# EAGLE schematic emonDC v0.3a (EAGLE 7.7.0)
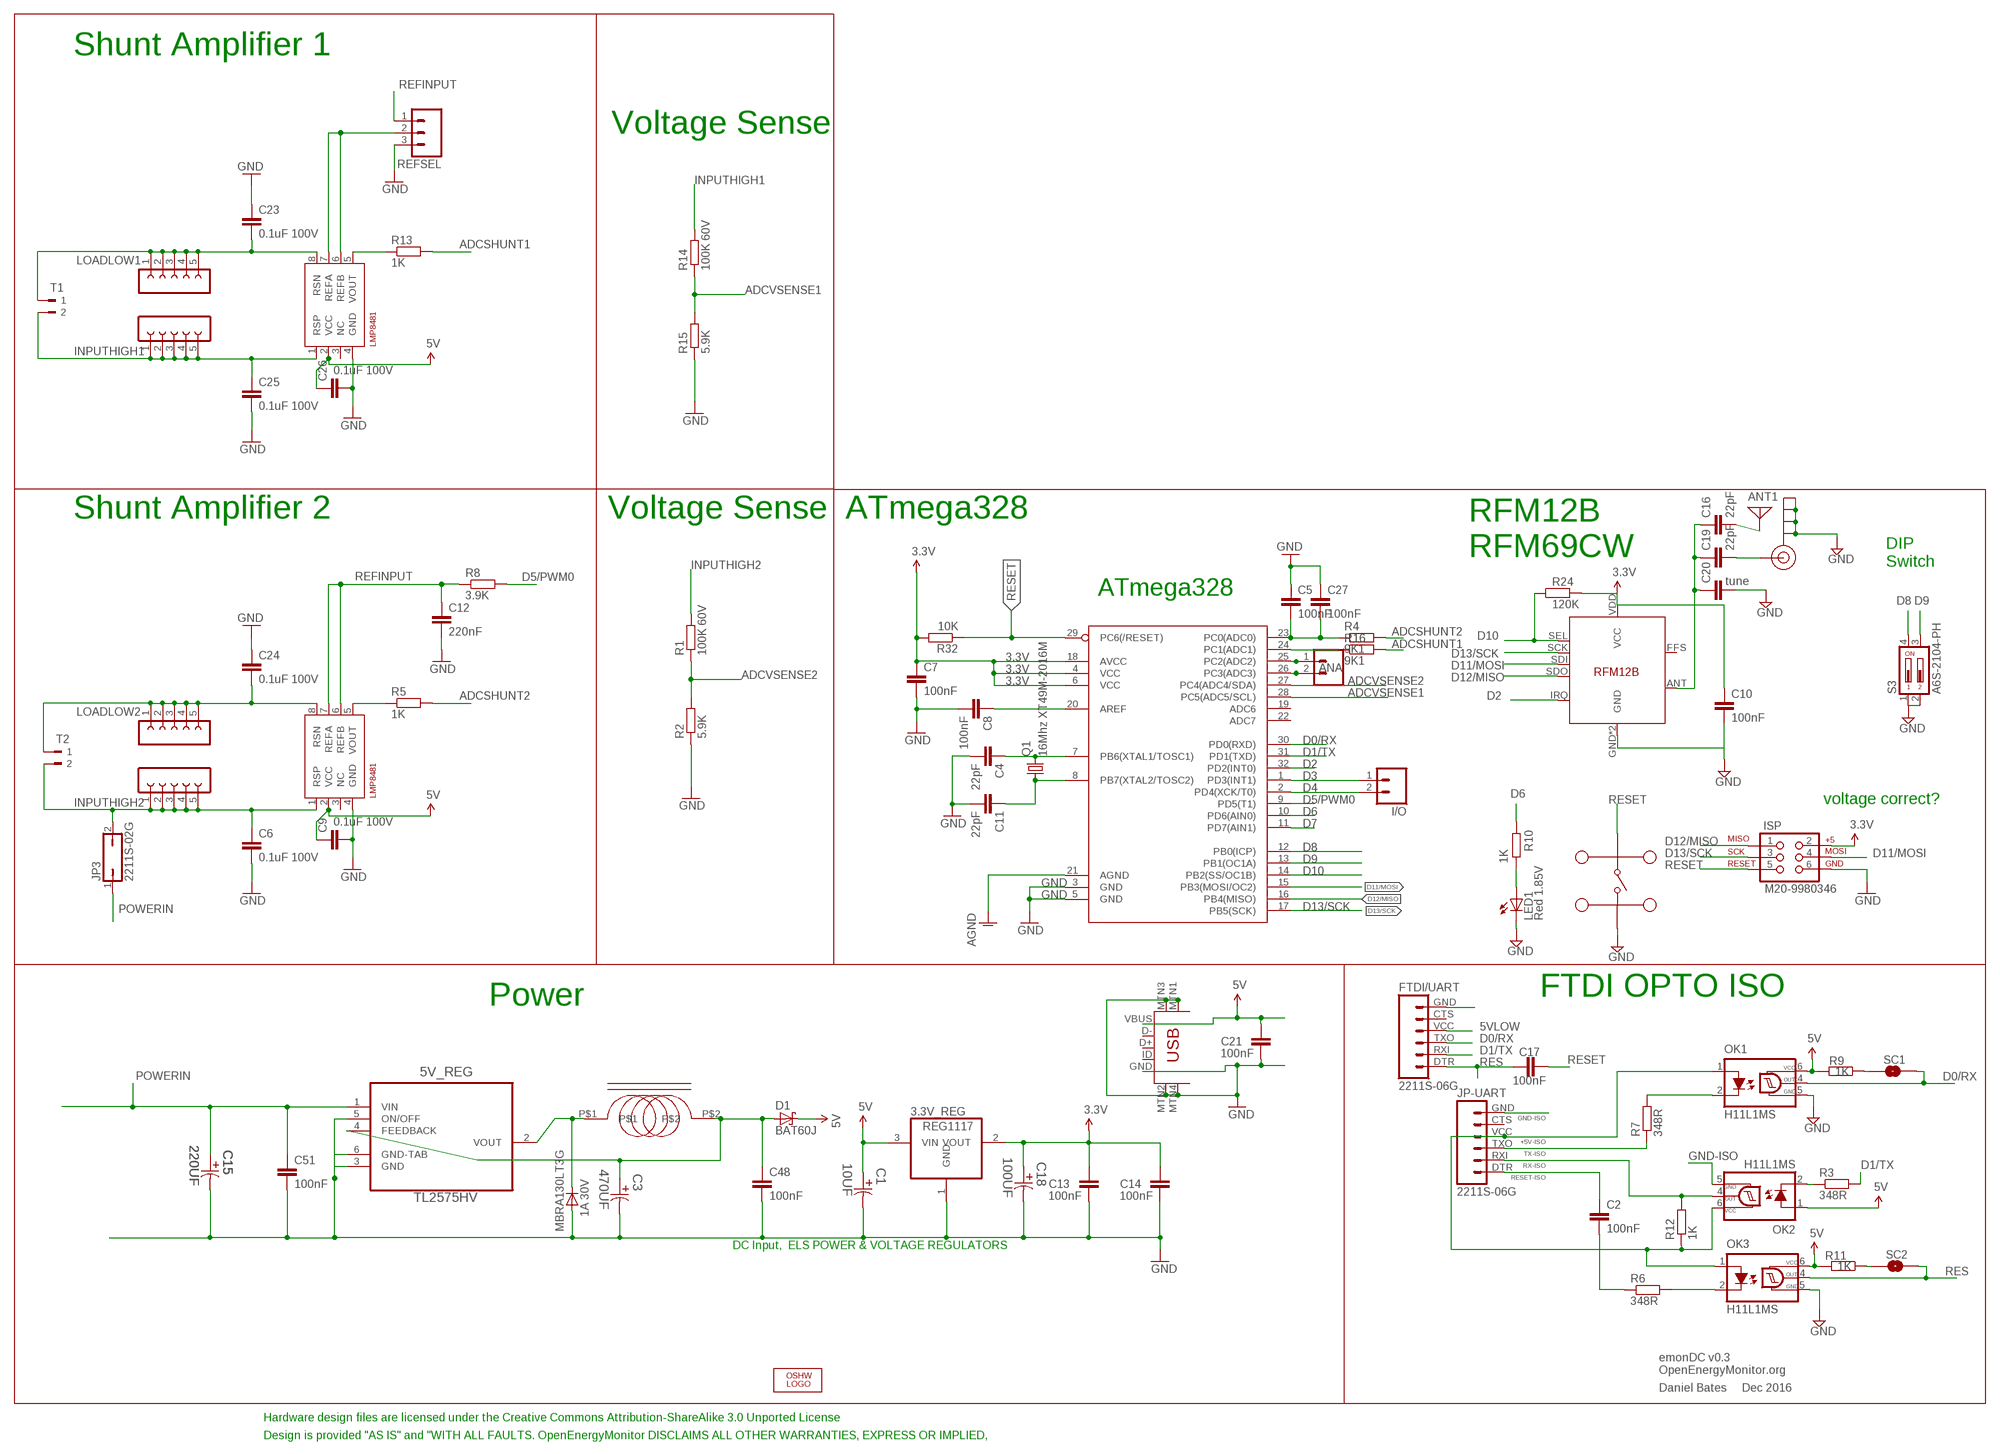
[diagram p0: schematic, sheet 1]

## Parts
3.3V_REG  REG1117  [SOT223]
5V_REG  TL2575HV  TL2575HV-05IKTTR  [TO-263]
ANA  2212S-02SG-85  M02LOCK  [1X02_LOCK]
ANT1  ANTENNA  [PAD-01]
C1  10UF  EEE-FK1E100R-CASE-B  [CAPAE430X610N]
C2  100nF  C-EUC0603  [C0603]
C3  470UF  EEE-FK1C471P-CASE-F  [CAPAE830X1050N]
C4  22pF  C-EUC0603  [C0603]
C5  100nF  C-EUC0603  [C0603]
C6  0.1uF 100V  C-EUC0603  [C0603]
C7  100nF  C-EUC0603  [C0603]
C8  100nF  C-EUC0603  [C0603]
C9  0.1uF 100V  C-EUC0603  [C0603]
C10  100nF  C-EUC0603  [C0603]
C11  22pF  C-EUC0603  [C0603]
C12  220nF  C-EUC0603  [C0603]
C13  100nF  C-EUC0603  [C0603]
C14  100nF  C-EUC0603  [C0603]
C15  220UF  EEV-FK1J221Q-CASE-H13  [CAPAE1350X1400N]
C16  22pF  C-EUC0603  [C0603]
C17  100nF  C-EUC0603  [C0603]
C18  100UF  EEE-FT0J101AR-CASE-B  [CAPAE430X610N]
C19  22pF  C-EUC0603  [C0603]
C20  tune  C-EUC0603  [C0603]
C21  100nF  C-EUC0603  [C0603]
C23  0.1uF 100V  C-EUC0603  [C0603]
C24  0.1uF 100V  C-EUC0603  [C0603]
C25  0.1uF 100V  C-EUC0603  [C0603]
C26  0.1uF 100V  C-EUC0603  [C0603]
C27  100nF  C-EUC0603  [C0603]
C48  100nF  C-EUC0603  [C0603]
C51  100nF  C-EUC0603  [C0603]
D1  BAT60J  [SOD323_ST]
D2  MBRA130LT3G  [DO-214]
FTDI/UART  2211S-06G  FTDI_BASICPTH  [FTDI_BASIC]
I1  SRR0603-331KL  [SRR0603-331KL]
I/O  2212S-02SG-85  M02LOCK  [1X02_LOCK]
ISP  M20-9980346  AVR_SPI_PRG_6PTH  [2X3]
J$1  SMA_EDGE  [SMA-EDGE]
JP3  2211S-02G  JP1Q  [JP1]
JP-LOAD  2212S-06SG-85  FE05-1  [FE05-1]
JP-LOAD1  2212S-06SG-85  FE05-1  [FE05-1]
JP-SOURCE  2212S-06SG-85  FE05-1  [FE05-1]
JP-SOURCE1  2212S-06SG-85  FE05-1  [FE05-1]
JP-UART  2211S-06G  FTDI_BASICPTH  [FTDI_BASIC]
LED1  Red 1.85V  LEDCHIP-LED0805  [CHIP-LED0805]
LMP1  LMP8481LMP8481-H  [S-PDSO-G08]
LMP8481  LMP8481-H  LMP8481LMP8481-H  [S-PDSO-G08]
LOGO1  OSHW_LOGO_6MILX0200-NT  [OSHW_6X200_NOTEXT]
MC32882  MC32882  [SWITCH_TACT_MULTICOMP]
OK1  H11L1MS  [DIL6-SMD]
OK2  H11L1MS  [DIL6-SMD]
OK3  H11L1MS  [DIL6-SMD]
Q1  16Mhz XT49M-2016M  CRYSTALHC49UP  [HC49UP]
R1  100K 60V  R-EU_R0603  [R0603]
R2  5.9K  R-EU_R0603  [R0603]
R3  348R  R-EU_R0603  [R0603]
R4  9K1  R-EU_R0603  [R0603]
R5  1K  R-EU_R0603  [R0603]
R6  348R  R-EU_R0603  [R0603]
R7  348R  R-EU_R0603  [R0603]
R8  3.9K  R-EU_R0603  [R0603]
R9  1K  R-EU_R0603  [R0603]
R10  1K  R-EU_R0603  [R0603]
R11  1K  R-EU_R0603  [R0603]
R12  1K  R-EU_R0603  [R0603]
R13  1K  R-EU_R0603  [R0603]
R14  100K 60V  R-EU_R0603  [R0603]
R15  5.9K  R-EU_R0603  [R0603]
R16  9K1  R-EU_R0603  [R0603]
R24  120K  R-EU_R0603  [R0603]
R32  10K  R-EU_R0603  [R0603]
REFSEL  2212S-02SG-85  CONN_03  [1X03]
RF  RFM12B  [RFM12B]
S3  A6S-2104-PH  2_SMT_DIP_SWITCH  [DIP_SWITCH_SMT]
SC1  SOLDERJUMPERNO  [SJ_2S-NO]
SC2  SOLDERJUMPERNO  [SJ_2S-NO]
T1  180-2  [180-2]
T2  180-2  [180-2]
U1_TQFP  ATMEGA328P  ATMEGA328_SMT  [TQFP32-08]
USB  MUSB-05-S-B-SM-A  USB-MINIB-5PIN  [USB-MINIB-CISECO]

## Nets
3.3V: 3.3V_REG.2(VOUT) C7.1 C10.1 C13.1 C14.1 C18.1 ISP.2 R24.2 R32.2 RF.VDD(VCC) U1_TQFP.4(VCC) U1_TQFP.6(VCC) U1_TQFP.18(AVCC)
5VHIGH [power]: 5V_REG.4(FEEDBACK) C3.1 C48.1 D1.A I1.P$2
5VLOW [power]: 3.3V_REG.3(VIN) C1.1 C9.1 C21.1 C26.1 D1.C FTDI/UART.VCC LMP1.2(VCC) LMP8481.2(VCC) OK1.6(VCC) OK2.1(A) OK3.6(VCC) R9.2 R11.2 USB.VBUS ; supply symbol labelled 5V
+5V-ISO [power]: JP-UART.VCC OK1.1(A) OK2.6(VCC) OK3.1(A) R12.1
ADCSHUNT1: R13.2 R16.2
ADCSHUNT2: R4.2 R5.2
ADCVSENSE1: R14.1 R15.2 U1_TQFP.28(PC5(ADC5/SCL))
ADCVSENSE2: R1.1 R2.2 U1_TQFP.27(PC4(ADC4/SDA))
AGND [thin_power]: U1_TQFP.21(AGND)
D0/RX: FTDI/UART.TXO OK1.4(OUT) SC1.1 U1_TQFP.30(PD0(RXD))
D1/TX: FTDI/UART.RXI R3.2 U1_TQFP.31(PD1(TXD))
D2: RF.IRQ U1_TQFP.32(PD2(INT0))
D3: I/O.1 U1_TQFP.1(PD3(INT1))
D4: I/O.2 U1_TQFP.2(PD4(XCK/T0))
D5/PWM0: R8.2 U1_TQFP.9(PD5(T1))
D6: R10.2 U1_TQFP.10(PD6(AIN0))
D7: U1_TQFP.11(PD7(AIN1))
D8: S3.4 U1_TQFP.12(PB0(ICP))
D9: S3.3 U1_TQFP.13(PB1(OC1A))
D10: R24.1 RF.SEL U1_TQFP.14(PB2(SS/OC1B))
D11/MOSI: ISP.4 RF.SDI U1_TQFP.15(PB3(MOSI/OC2))
D12/MISO: ISP.1 RF.SDO U1_TQFP.16(PB4(MISO))
D13/SCK: ISP.3 RF.SCK U1_TQFP.17(PB5(SCK))
DIG1: C16.1 C19.1 C20.1 RF.ANT
GND [thin_power]: 3.3V_REG.1(GND) 5V_REG.3(GND) 5V_REG.5(ON/OFF) 5V_REG.6(GND-TAB) C1.2 C3.2 C4.2 C5.1 C6.2 C7.2 C8.2 C9.2 C10.2 C11.2 C12.2 C13.2 C14.2 C15.2 C18.2 C20.2 C21.2 C23.1 C24.1 C25.2 C26.2 C27.1 C48.2 C51.2 D2.P$2(A) FTDI/UART.GND ISP.6 J$1.GND@0(GND) J$1.GND@1(GND) J$1.GND@2(GND) J$1.GND@3(GND) LED1.C LMP1.4(GND) LMP8481.4(GND) MC32882.P$3 MC32882.P$4 OK1.5(GND) OK3.5(GND) R2.1 R15.1 REFSEL.3 RF.GND RF.P$12(GND) S3.1 S3.2 U1_TQFP.3(GND) U1_TQFP.5(GND) USB.GND USB.MTN1(MTN2) USB.MTN2(MTN3) USB.MTN3(MTN1) USB.MTN4
GND-ISO [thin_power]: JP-UART.GND OK2.5(GND)
IND: 5V_REG.2(VOUT) D2.P$1(C) I1.P$1
INPUTHIGH1: C25.1 JP-LOAD1.1 JP-LOAD1.2 JP-LOAD1.3 JP-LOAD1.4 JP-LOAD1.5 LMP1.1(RSP) R14.2 T1.2
INPUTHIGH2: C6.1 JP3.2 JP-LOAD.1 JP-LOAD.2 JP-LOAD.3 JP-LOAD.4 JP-LOAD.5 LMP8481.1(RSP) R1.2 T2.2
LOADLOW1: C23.2 JP-SOURCE1.1 JP-SOURCE1.2 JP-SOURCE1.3 JP-SOURCE1.4 JP-SOURCE1.5 LMP1.8(RSN) T1.1
LOADLOW2: C24.2 JP-SOURCE.1 JP-SOURCE.2 JP-SOURCE.3 JP-SOURCE.4 JP-SOURCE.5 LMP8481.8(RSN) T2.1
N$1: C4.1 Q1.2 U1_TQFP.7(PB6(XTAL1/TOSC1))
N$2: C5.2 C27.2 R4.1 U1_TQFP.23(PC0(ADC0))
N$3: R11.1 SC2.2
N$4: LMP1.5(VOUT) R13.1
N$5: R9.1 SC1.2
N$6: LMP8481.5(VOUT) R5.1
N$9: C11.1 Q1.1 U1_TQFP.8(PB7(XTAL2/TOSC2))
N$10: C2.1 JP-UART.DTR
N$11: ANT1.1 C16.2
N$13: OK1.2(C) R7.2
N$15: OK2.2(C) R3.1
N$17: OK3.2(C) R6.2
N$20: C8.1 U1_TQFP.20(AREF)
N$22: ANA.2 U1_TQFP.26(PC3(ADC3))
N$23: ANA.1 U1_TQFP.25(PC2(ADC2))
N$24: C19.2 J$1.SIG(SIGNAL)
N$27: R16.1 U1_TQFP.24(PC1(ADC1))
N$28 [thin_power]: LMP1.6(REFB) LMP1.7(REFA) REFSEL.2
N$41: LED1.A R10.1
POWERIN: 5V_REG.1(VIN) C15.1 C51.1 JP3.1
REFINPUT: C12.1 LMP8481.6(REFB) LMP8481.7(REFA) R8.1 REFSEL.1
RES: C17.1 FTDI/UART.DTR OK3.4(OUT) SC2.1
RESET: C17.2 ISP.5 MC32882.P$1 MC32882.P$2 R32.1 U1_TQFP.29(PC6(/RESET))
RESET-ISO: C2.2 R6.1
RX-ISO: JP-UART.RXI OK2.4(OUT) R12.2
TX-ISO: JP-UART.TXO R7.1
Unconnected: FTDI/UART.CTS JP-UART.CTS LMP1.3(NC) LMP8481.3(NC) RF.FFS U1_TQFP.19(ADC6) U1_TQFP.22(ADC7) USB.D+ USB.D- USB.ID

## Notes on the sheet
- Shunt Amplifier 1
- Voltage Sense
- Shunt Amplifier 2 | Voltage Sense | ATmega328
- RFM12B
  RFM69CW
- DIP
  Switch
- ATmega328
- voltage correct?
- Power | FTDI OPTO ISO
- DC Input,  ELS POWER & VOLTAGE REGULATORS
- emonDC v0.3
  OpenEnergyMonitor.org
- Daniel Bates     Dec 2016
- Hardware design files are licensed under the Creative Commons Attribution-ShareAlike 3.0 Unported License
- Design is provided "AS IS" and "WITH ALL FAULTS. OpenEnergyMonitor DISCLAIMS ALL OTHER WARRANTIES, EXPRESS OR IMPLIED,

## Library data of the parts
3.3V_REG = burr-brown:REG1117: 800mA and 1A Low Dropout (LDO) Positive Regulator 1.8V, 2.5V, 2.85V, 3.3V, 5V, and Adj; MF: TEXAS INSTRUMENTS; MPN: REG1117; OC_FARNELL: 1097566; OC_NEWARK: 14P6981
5V_REG = TL2575HV:TL2575HV; MF: TEXAS INSTRUMENTS; MPN: LM2575HVS-15/NOPB; OC_FARNELL: 2492609
ANA I/O = SparkFun-Connectors:M02: Standard 2-pin 0.1" header. Use with - straight break away headers ( PRT-00116) - right angle break away headers (PRT-00553) - swiss pins (PRT-00743) - machine pins (PRT-00117) - female headers (PRT-00115) Molex polarized connector foot print use with: PRT-08233 with associated crimp pins and housings. 2.54_SCREWTERM for use with PRT-10571. 3.5mm Screw Terminal footprints for PRT-08084 5mm Screw Terminal footprints for use with PRT-08432; MF: MULTICOMP; MPN: 2212S-02SG-85; OC_FARNELL: 1593458
ANT1 = discrete:ANTENNA: Antenna; OC_FARNELL: unknown
C1 = Panasonic-EEEFK_EEEFP:EEE-: Aluminum Electrolytic Capacitors,Surface Mount Type; MPN: EEE-FK1E100R; OC_FARNELL: 9695729; OC_NEWARK: 96K9386; PACKAGE: CASE-B; SUPPLIER: PANASONIC; TOLERANCE: ±20 %; VOLTAGERATING: 25V
C2 C4 C5 C7 C8 C10-C14 C16 C17 C19-C21 C27 C48 C51 = rcl:C-EU: CAPACITOR, European symbol
C3 = Panasonic-EEEFK_EEEFP:EEE-: Aluminum Electrolytic Capacitors,Surface Mount Type; MPN: EEE-FK1C471P; OC_FARNELL: 9695710; OC_NEWARK: 96K9385; PACKAGE: CASE-F; SUPPLIER: PANASONIC; TOLERANCE: ±20 %; VOLTAGERATING: 16V
C6 C9 C23-C26 = rcl:C-EU: CAPACITOR, European symbol; MPN: C1608X7S2A104K080AB
C15 = Panasonic-EEE-EEV-EEF-ECQ:EEV-: Aluminum Electrolytic Capacitors,Surface Mount Type; MPN: EEVFK1J221Q; OC_FARNELL: 9696059; OC_NEWARK: 96K9481; SUPPLIER: PANASONIC; TOLERANCE: ±20 %; VOLTAGERATING: 63V
C18 = Panasonic-EEEFT_EEEH:EEE-: Aluminum Electrolytic Capacitors,Surface Mount Type; MPN: EEE-FT0J101AR; OC_FARNELL: 2065951; OC_NEWARK: 73T9146; PACKAGE: CASE-B; SUPPLIER: PANASONIC; TOLERANCE: ±20 %; VOLTAGERATING: 6.3V
D1 = diode:BAT60J: Schottky barrier diode Source: www.st.com, BAT60J.pdf
D2 = CASE 403D Diode:MBRA130LT3G: Fast switching diode; MF: ON SEMICONDUCTOR; MPN: MBRA130LT3G; OC_FARNELL: 9555978
FTDI/UART JP-UART = SparkFun:FTDI_BASIC: FTDI Basic: 3.3V and 5V; MF: MULTICOMP; MPN: 2211S-06G; OC_FARNELL: 1593415
I1 = SRR0603-331KL:SRR0603-331KL: SRR0603-331KL; INDUCTANCE: 330uH; MF: BOURNS; MPN: SRR0603-331KL; OC_FARNELL: 2333890
ISP = SparkFun:AVR_SPI_PRG_6: AVR ISP 6 Pin This is the reduced ISP connector for AVR programming. Common on Arduino. This footprint will take up less PCB space and can be used with a 10-pin to 6-pin adapter such as SKU: BOB-08508; MF: HARWIN; MPN: M20-9980346; OC_FARNELL: 1022231
J$1 = SparkFun-Connectors:SMA_EDGE: SMA Antenna Connector End launch SMA connector. The paste layer has been removed so that the connector can be hand soldered onto the board after reflow.; OC_FARNELL: unknown
JP3 = jumper:JP1Q: JUMPER; MF: MULTICOMP; MPN: 2211S-02G; OC_FARNELL: 1593411
JP-LOAD JP-LOAD1 JP-SOURCE JP-SOURCE1 = con-lsta:FE05-1: FEMALE HEADER; MF: MULTICOMP; MPN: 2212S-06SG-85; OC_FARNELL: 1593462; OC_NEWARK: unknown
LED1 = adafruit:LED: LED OSRAM: - CHIPLED LG R971, LG N971, LY N971, LG Q971, LY Q971, LO R971, LY R971 LH N974, LH R974 LS Q976, LO Q976, LY Q976 LO Q996 - Hyper CHIPLED LW Q18S LB Q993, LB Q99A, LB R99A - SideLED LS A670, LO A670, LY A670, LG A670, LP A670 LB A673, LV A673, LT A673, LW A673 LH A674 LY A675 LS A676, LA A676, LO A676, LY A676, LW A676 LS A679, LY A679, LG A679 - Hyper Micro SIDELED® LS Y876, LA Y876, LO Y876, LY Y876 LT Y87S - SmartLED LW L88C, LW L88S LB L89C, LB L89S, LG L890 LS L89K, LO L89K, LY L89K LS L896, LA L896, LO L896, LY L896 - TOPLED LS T670, LO T670, LY T670, LG T670, LP T670 LSG T670, LSP T670, LSY T670, LOP T670, LYG T670 LG T671, LOG T671, LSG T671 LB T673, LV T673, LT T673, LW T673 LH T674 LS T676, LA T676, LO T676, LY T676, LB T676, LH T676, LSB T676, LW T676 LB T67C, LV T67C, LT T67C, LS T67K, LO T67K, LY T67K, LW E67C LS E67B, LA E67B, LO E67B, LY E67B, LB E67C, LV E67C, LT E67C LW T67C LS T679, LY T679, LG T679 LS T770, LO T770, LY T770, LG T770, LP T770 LB T773, LV T773, LT T773, LW T773 LH T774 LS E675, LA E675, LY E675, LS T675 LS T776, LA T776, LO T776, LY T776, LB T776 LHGB T686 LT T68C, LB T68C - Hyper Mini TOPLED® LB M676 - Mini TOPLED Santana® LG M470 LS M47K, LO M47K, LY M47K Source: http://www.osram.convergy.de/; MF: ROHM; MPN: SML-211UTT86K; OC_FARNELL: 1685056
LMP1 = libsexportlmp8481b:LMP8481: LMP8481MM-H/NOPB 100V/V; MF: TEXAS INSTRUMENTS; MPN: LMP8481MME-S/NOPB; OC_FARNELL: 2322044
LMP8481 = libsexportlmp8481b:LMP8481: LMP8481MM-H/NOPB 100V/V; MF: TEXAS INSTRUMENTS; MPN: LMP8481MME-H/NOPB; OC_FARNELL: 2322044
LOGO1 = ohw-logo:OSHW_LOGO_6MIL; OC_FARNELL: unknown
MC32882 = multicomp tact switch:MC32882
OK1-OK3 = optocoupler:H11L*M: 6-Pin DIP Optocoupler Source: http://www.fairchildsemi.com/ds/H1/H11L2-M.pdf; OC_FARNELL: unknown; OC_NEWARK: unknown
Q1 = adafruit:CRYSTAL: CRYSTAL; MF: VISHAY; MPN: XT49M-2016M; OC_FARNELL: 1469641; OC_NEWARK: unknown
R1 R14 = rcl:R-EU_: RESISTOR, European symbol; MPN: MCWR06X1003FTL
R2 R15 = rcl:R-EU_: RESISTOR, European symbol; MPN: MCWR06X5901FTL
R3-R13 R16 R24 R32 = rcl:R-EU_: RESISTOR, European symbol
REFSEL = SparkFun-Connectors:CONN_03: Multi connection point. Often used as Generic Header-pin footprint for 0.1 inch spaced/style header connections On any of the 0.1 inch spaced packages, you can populate with these: Break Away Headers - Straight <https://www.sparkfun.com/products/116> (PRT-00116) Break Away Male Headers - Right Angle <https://www.sparkfun.com/products/553> (PRT-00553) Female Headers <https://www.sparkfun.com/products/115> (PRT-00115) Break Away Headers - Machine Pin <https://www.sparkfun.com/products/117> (PRT-00117) Break Away Female Headers - Swiss Machine Pin <https://www.sparkfun.com/products/743> (PRT-00743) Stackable Header - 3 Pin (Female, 0.1") <https://www.sparkfun.com/products/13875> (PRT-13875) For SCREWTERMINALS and SPRING TERMINALS visit here: Screw Terimnals on SparkFun.com <https://www.sparkfun.com/search/results?term=Screw+Terminals> (5mm/3.5mm/2.54mm spacing) This device is also useful as a general connection point to wire up your design to another part of your project. Our various solder wires solder well into these plated through hole pads. Hook-Up Wire - Assortment (Stranded, 22 AWG) <https://www.sparkfun.com/products/11375> (PRT-11375) Hook-Up Wire - Assortment (Solid Core, 22 AWG) <https://www.sparkfun.com/products/11367> (PRT-11367) View the entire wire category on our website here <https://www.sparkfun.com/categories/141> Special notes: Molex polarized connector foot print use with SKU : PRT-08232 with associated crimp pins and housings.; MF: MULTICOMP; MPN: 2212S-02SG-85; OC_FARNELL: 1593458
RF = JeeParts:RFM12B; OC_FARNELL: unknown
S3 = OpenEnergyMonitor:2_SMT_DIP_SWITCH: Multicomp MCEMR-02-T 2 throw SMT DIP switch, Farnell 1524005; MF: OMRON ELECTRONIC COMPONENTS; MPN: A6S2104H; OC_FARNELL: 1960894
SC1 SC2 = SparkFun:SOLDERJUMPER: Solder Jumper Standard SMD solder jumper. Used to automate production. Two varients : Normally Open and Normally Closed are the same, but have different paste layers. NC will have a large amount of paste and should jumper during reflow.
T1 T2 = con-weidmueller-sl35:180-2: WEIDMUELLER CLAMP CONNECTOR; OC_FARNELL: unknown; OC_NEWARK: unknown
U1_TQFP = SparkFun-DigitalIC:ATMEGA328_SMT: 32-Pin Atmega328 part Commonly used on Arduino compatible boards Available in QFP and QFN packages TQFP is IC-09069 QFN is non-stock; MF: ATMEL; MPN: ATMEGA328-AU; OC_FARNELL: 1972086; PROD_ID: IC-09069
USB = Ciseco USB miniB:USB-MINIB: Mini-USB "B" connector with 5th pin broken out. Created new symbol breaking out 5th "ID" pin in mini/micro USB connector spec. See: http://en.wikipedia.org/wiki/Mini_usb#Cables. Uses same footprint as 4-pin symbol. Also added pins to connect to mounting / shield pads if required (probably not generally needed as signals aren't shielded once they leave the connector). Modified by Ciseco for Rapid Part 24-0357; MF: MOLEX; MPN: 67503-1020; OC_FARNELL: 1125348

## Net classes
2 thin_power: width 0.254 mm